# Altium project Bicycle_Project.PrjPcb
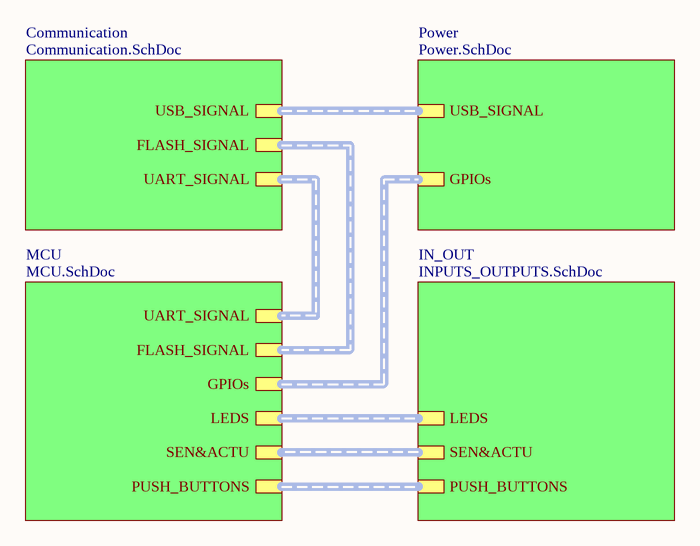
[diagram p0: main.SchDoc]
5 sheets, 108 parts. Net scope: hierarchical (ports join the sheet entries above them; power ports are global).
Board file: Bicycle_Project.PcbDoc
Sheets:
  main.SchDoc
    Communication = Communication.SchDoc
    MCU = MCU.SchDoc
    Power = Power.SchDoc
    IN_OUT = INPUTS_OUTPUTS.SchDoc

## Sheet main.SchDoc: BICYCLE_PROJECT
size A4; SheetNumber: 1; SheetTotal: 5

### Sub-sheets
Communication = Communication.SchDoc: USB_SIGNAL (harness USB_SIGNAL), UART_SIGNAL (harness UART_SIGNAL), FLASH_SIGNAL (harness FLASH_SIGNAL)
IN_OUT = INPUTS_OUTPUTS.SchDoc: LEDS (harness LEDS), PUSH_BUTTONS (harness PUSH_BUTTONS), SEN&ACTU (harness SENSORS&ACTUATORS)
MCU = MCU.SchDoc: UART_SIGNAL (harness UART_SIGNAL), LEDS (harness LEDS), PUSH_BUTTONS (harness PUSH_BUTTONS), FLASH_SIGNAL (harness FLASH_SIGNAL), SEN&ACTU (harness SENSORS&ACTUATORS), GPIOs (harness GPIOs)
Power = Power.SchDoc: USB_SIGNAL (harness USB_SIGNAL), GPIOs (harness GPIOs)

### Buses and harness runs
harness sheet Communication/FLASH_SIGNAL = sheet MCU/FLASH_SIGNAL
harness sheet Communication/UART_SIGNAL = sheet MCU/UART_SIGNAL
harness sheet Communication/USB_SIGNAL = sheet Power/USB_SIGNAL
harness sheet IN_OUT/LEDS = sheet MCU/LEDS
harness sheet IN_OUT/PUSH_BUTTONS = sheet MCU/PUSH_BUTTONS
harness sheet IN_OUT/SEN&ACTU = sheet MCU/SEN&ACTU
harness sheet MCU/GPIOs = sheet Power/GPIOs

## Sheet Communication.SchDoc
size A4; SheetNumber: 4; SheetTotal: 5
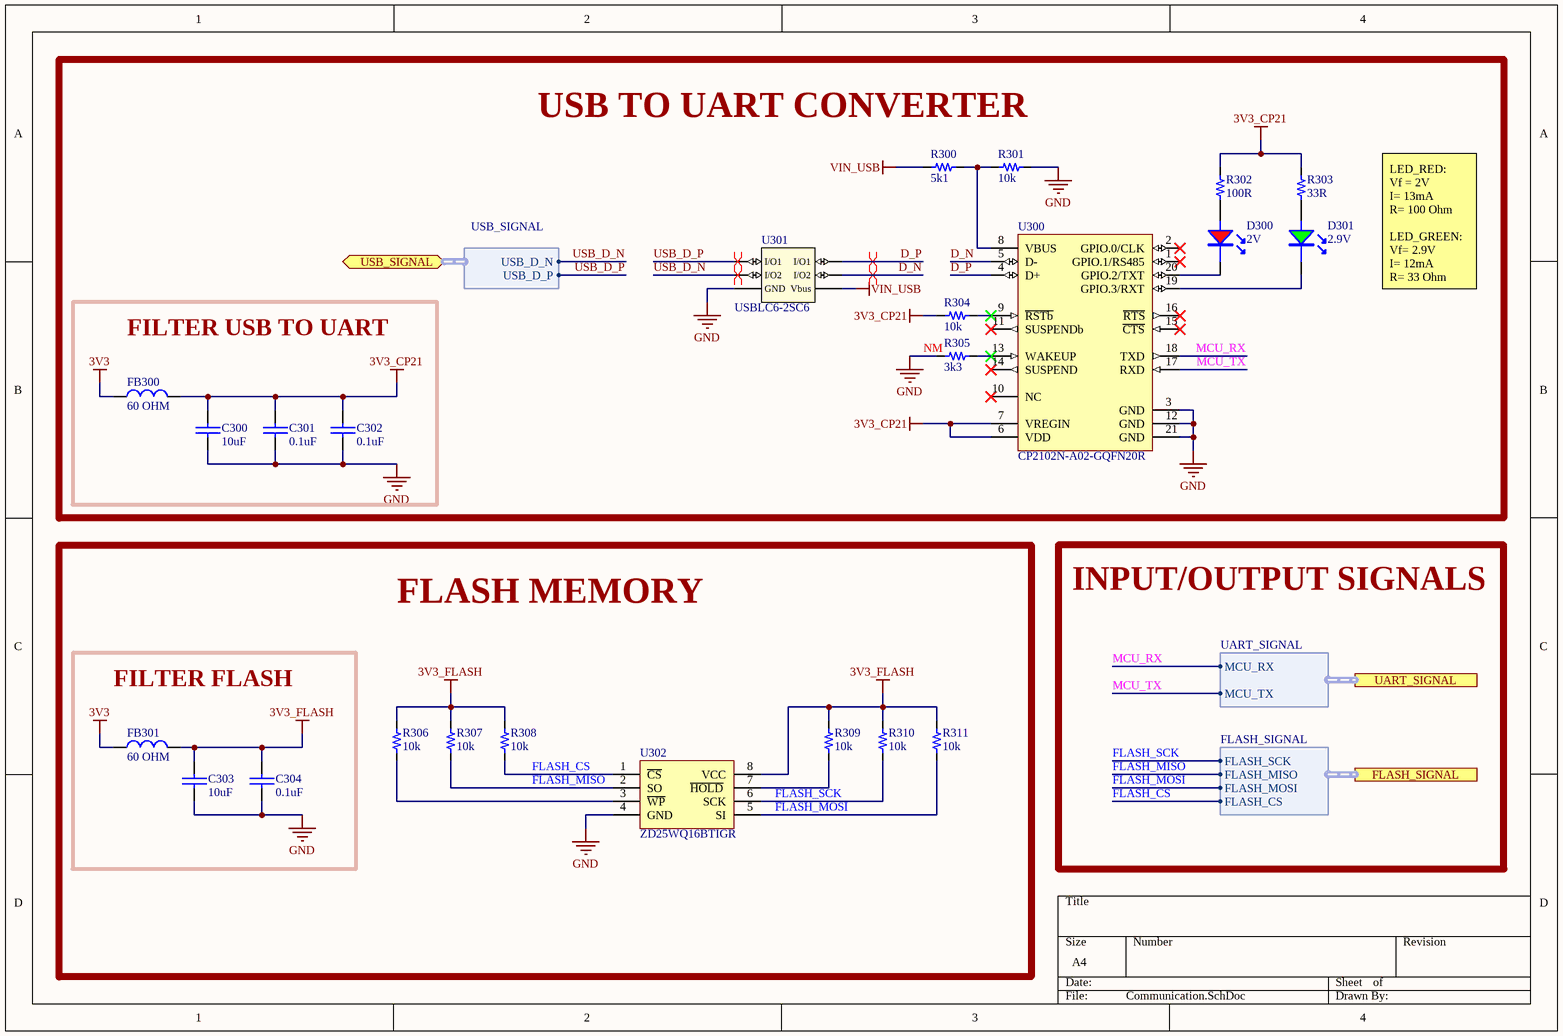
[diagram p1: Communication.SchDoc]

### Parts
C300  value 10uF  [0603_cap]  (hidden comment: 10uF 10V)
C301  value 0.1uF  [0603_cap]  (hidden comment: 0.1uF 50V)
C302  value 0.1uF  [0603_cap]  (hidden comment: 0.1uF 50V)
C303  value 10uF  [0603_cap]  (hidden comment: 10uF 10V)
C304  value 0.1uF  [0603_cap]  (hidden comment: 0.1uF 50V)
D300  2V  [0805_LED]
D301  2.9V  [0805_LED]
FB300  value 60 OHM  [0603_fb]  (hidden comment: 60OHM 2A)
FB301  value 60 OHM  [0603_fb]  (hidden comment: 60OHM 2A)
R300  value 5k1  [0603_res]  (hidden comment: 5k1 1/10W)
R301  value 10k  [0603_res]  (hidden comment: 10k 1/10W)
R302  value 100R  [0603_res]  (hidden comment: 100R 1/10W)
R303  value 33R  [0603_res]  (hidden comment: 33R 1/10W)
R304  value 10k  [0603_res]  (hidden comment: 10k 1/10W)
R305  value 3k3  Usage: NM  [0603_res]  (hidden comment: 3k3 1/10W)
R306  value 10k  [0603_res]  (hidden comment: 10k 1/10W)
R307  value 10k  [0603_res]  (hidden comment: 10k 1/10W)
R308  value 10k  [0603_res]  (hidden comment: 10k 1/10W)
R309  value 10k  [0603_res]  (hidden comment: 10k 1/10W)
R310  value 10k  [0603_res]  (hidden comment: 10k 1/10W)
R311  value 10k  [0603_res]  (hidden comment: 10k 1/10W)
U300  CP2102N-A02-GQFN20R  [WFQFN_20_EP_3X3MM]
U301  USBLC6-2SC6  [SOT_23_6]
U302  ZD25WQ16BTIGR  [SOIC_8_3.9mm]

### Blocks framed on the sheet
USB TO UART CONVERTER: D300 D301 R300-R305 U300 U301
FILTER USB TO UART: C300-C302 FB300
FLASH MEMORY: R306-R311 U302
FILTER FLASH: C303 C304 FB301

### Ports
FLASH_SIGNAL (harness FLASH_SIGNAL, see main[3B], MCU[4B]), UART_SIGNAL (harness UART_SIGNAL, see main[3B], MCU[4D]), USB_SIGNAL (bidir, harness USB_SIGNAL, see main[3B], Power[2A])

### Harnesses
USB_SIGNAL: USB_D_N, USB_D_P
UART_SIGNAL: MCU_TX, MCU_RX
FLASH_SIGNAL: FLASH_SCK, FLASH_MISO, FLASH_MOSI, FLASH_CS

### Nets
3V3: FB300.1 FB301.2
3V3_CP21: C300.1 C301.1 C302.1 FB300.2 R302.2 R303.2 R304.1 U300.6(VDD) U300.7(VREGIN)
3V3_FLASH: C303.1 C304.1 FB301.1 R306.2 R307.2 R308.1 R309.2 R310.2 R311.2 U302.8(VCC)
GND: C300.2 C301.2 C302.2 C303.2 C304.2 R301.2 R305.1 U300.3(GND) U300.12(GND) U300.21(GND) U301.2(GND) U302.4(GND)
VIN_USB: R300.1 U301.5(Vbus)
D_N: U300.5(D-) U301.4(I/O2)
D_P: U300.4(D+) U301.6(I/O1)
FLASH_CS: R308.2 U302.1(~{CS}) ; port FLASH_SIGNAL.FLASH_CS
FLASH_MISO: R307.1 U302.2(SO) ; port FLASH_SIGNAL.FLASH_MISO
FLASH_MOSI: R311.1 U302.5(SI) ; port FLASH_SIGNAL.FLASH_MOSI
FLASH_SCK: R310.1 U302.6(SCK) ; port FLASH_SIGNAL.FLASH_SCK
MCU_RX: U300.18(TXD) ; port UART_SIGNAL.MCU_RX
MCU_TX: U300.17(RXD) ; port UART_SIGNAL.MCU_TX
USB_D_N: U301.3(I/O2) ; port USB_SIGNAL.USB_D_N
USB_D_P: U301.1(I/O1) ; port USB_SIGNAL.USB_D_P
NetD300_1: D300.1(A) R302.1
NetD300_2: D300.2 U300.20(GPIO.2/TXT)
NetD301_1: D301.1(A) R303.1
NetD301_2: D301.2 U300.19(GPIO.3/RXT)
NetR300_2: R300.2 R301.1 U300.8(VBUS)
NetR304_2: R304.2 U300.9(~{RSTb})
NetR305_2: R305.2 U300.13(WAKEUP)
NetR306_1: R306.1 U302.3(~{WP})
NetR309_1: R309.1 U302.7(~{HOLD})

Not connected (* = marked no-connect by the designer): U300 1(GPIO.1/RS485)* 2(GPIO.0/CLK)* 10(NC)* 11(SUSPENDb)* 14(SUSPEND)* 15(~{CTS})* 16(~{RTS})*

### Layout directives
differential pair: D_N, D_P, USB_D_N, USB_D_P

### Notes on the sheet
- LED_RED:
  Vf = 2V
  I= 13mA
  R= 100 Ohm
  LED_GREEN:
  Vf= 2.9V
  I= 12mA
  R= 33 Ohm
- INPUT/OUTPUT SIGNALS

### Library data of the parts
C300 C303 = Cap_10uF_0603_10V: 10V 10uF X5R ±10% 0603 Multilayer Ceramic Capacitors MLCC - SMD/SMT ROHS; Manufacturer: CCTC; Manufacturer Part Number: TCC0603X5R106K100CT; Supplier 1: LCSC; Supplier Part Number 1: C380314; ComponentLink1Description: LCSC; ComponentLink1URL: https://www.lcsc.com/product-detail/Multilayer-Ceramic-Capacitors-MLCC-SMD-SMT_CCTC-TCC0603X5R106K100CT_C380314.html
C301 C302 C304 = Cap_0.1uF_0603_50V: 50V 100nF Y5V -20%~+80% 0603 Multilayer Ceramic Capacitors MLCC - SMD/SMT ROHS; Manufacturer: Walsin Tech Corp; Manufacturer Part Number: 0603F104Z500CT; Supplier 1: LCSC; Supplier Part Number 1: C83060; ComponentLink1Description: LCSC; ComponentLink1URL: https://www.lcsc.com/product-detail/Multilayer-Ceramic-Capacitors-MLCC-SMD-SMT_Walsin-Tech-Corp-0603F104Z500CT_C83060.html
D300 = LED_0805_RED: LED RED CLEAR 0805 SMD; Manufacturer: XINGLIGHT; Manufacturer Part Number: XL-2012SURC; Supplier 1: LCSC; Supplier Part Number 1: C965812; ComponentLink1Description: LCSC; ComponentLink1URL: https://www.lcsc.com/product-detail/Light-Emitting-Diodes-LED_XINGLIGHT-XL-2012SURC_C965812.html
D301 = LED_0805_Green: LED GREEN CLEAR 0805 SMD; Manufacturer: XINGLIGHT; Manufacturer Part Number: XL-2012UGC; Supplier 1: LCSC; Supplier Part Number 1: C965815; ComponentLink1Description: LCSC; ComponentLink1URL: https://www.lcsc.com/product-detail/Light-Emitting-Diodes-LED_XINGLIGHT-XL-2012UGC_C965815.html
FB300 FB301 = FB_60_0603_2A: 2A 1 100mΩ 60Ω@100MHz ±25% 0603 Ferrite Beads ROHS; Manufacturer: TAI-TECH; Manufacturer Part Number: HCB1608KF-600T20; ComponentLink1Description: LCSC; ComponentLink1URL: https://www.lcsc.com/product-detail/Ferrite-Beads_TAI-TECH-HCB1608KF-600T20_C369516.html; Supplier 1: LCSC; Supplier Part Number 1: C369516
R300 = Res_5k1_0603_1/10W: RES SMD 5k1 OHM 5% 1/10W 0603; Manufacturer: FOJAN; Manufacturer Part Number: FRC0603J512 TS; ComponentLink1URL: https://www.lcsc.com/product-detail/Chip-Resistor-Surface-Mount_FOJAN-FRC0603J512-TS_C2907114.html; Supplier 1: LCSC; Supplier Part Number 1: C2907114; ComponentLink1Description: LCSC
R301 R304 R306-R311 = Res_10k_0603_1/10W: RES SMD 10k OHM 5% 1/10W 0603; Manufacturer: FOJAN; Manufacturer Part Number: FRC0603J103TS; ComponentLink1URL: https://www.lcsc.com/product-detail/Chip-Resistor-Surface-Mount_FOJAN-FRC0603J103TS_C2930027.html; Supplier 1: LCSC; Supplier Part Number 1: C2930027; ComponentLink1Description: LCSC
R302 = Res_100R_0603_1/10W: RES SMD 100R OHM 5% 1/10W 0603; Manufacturer: FOJAN; Manufacturer Part Number: FRC0603J101 TS; ComponentLink1URL: https://www.lcsc.com/product-detail/Chip-Resistor-Surface-Mount_FOJAN-FRC0603J101-TS_C2907089.html; Supplier 1: LCSC; Supplier Part Number 1: C2907089; ComponentLink1Description: LCSC
R303 = Res_33R_0603_1/10W: RES SMD 33R OHM 5% 1/10W 0603; Manufacturer: FOJAN; Manufacturer Part Number: FRC0603J330 TS; ComponentLink1URL: https://www.lcsc.com/product-detail/Chip-Resistor-Surface-Mount_FOJAN-FRC0603J330-TS_C2907154.html; Supplier 1: LCSC; Supplier Part Number 1: C2907154; ComponentLink1Description: LCSC
R305 = Res_3k3_0603_1/10W: RES SMD 3k3 OHM 5% 1/10W 0603; Manufacturer: FOJAN; Manufacturer Part Number: FRC0603J332 TS; ComponentLink1URL: https://www.lcsc.com/product-detail/Chip-Resistor-Surface-Mount_FOJAN-FRC0603J332-TS_C2907140.html; Supplier 1: LCSC; Supplier Part Number 1: C2907140; ComponentLink1Description: LCSC
U300 = IC_SGL_USB2UART-BRIDGE_20QFN: IC USB TO UART BRIDGE QFN20; Manufacturer: Silicon Labs; Manufacturer Part Number: CP2102N-A02-GQFN20R; Supplier 1: LCSC; Supplier Part Number 1: C969913; ComponentLink1Description: LCSC; ComponentLink1URL: https://www.lcsc.com/product-detail/USB-ICs_SILICON-LABS-CP2102N-A02-GQFN20R_C969913.html
U301 = TVS_5.25V_2CH_SOT_23_6: TVS DIODE 5.25V 17V SOT23-6; Manufacturer: STMicroelectronics; ComponentLink1Description: LCSC; ComponentLink1URL: https://www.lcsc.com/product-detail/ESD-Protection-Devices_STMicroelectronics-USBLC6-2SC6_C7519.html; Supplier 1: LCSC; Manufacturer Part Number: USBLC6-2SC6; Supplier Part Number 1: C7519
U302 = IC_FLASH_ZD25WQ16BTIGR_8SOP: IC FLASH 16M SPI 85MHZ 8SOP; Manufacturer: Zetta; Manufacturer Part Number: ZD25WQ16BTIGR; Supplier 1: LCSC; Supplier Part Number 1: C2896790; ComponentLink1Description: LCSC; ComponentLink1URL: https://www.lcsc.com/product-detail/NOR-FLASH_Zetta-ZD25WQ16BTIGR_C2896790.html

## Sheet MCU.SchDoc
size A4; SheetNumber: 2; SheetTotal: 5
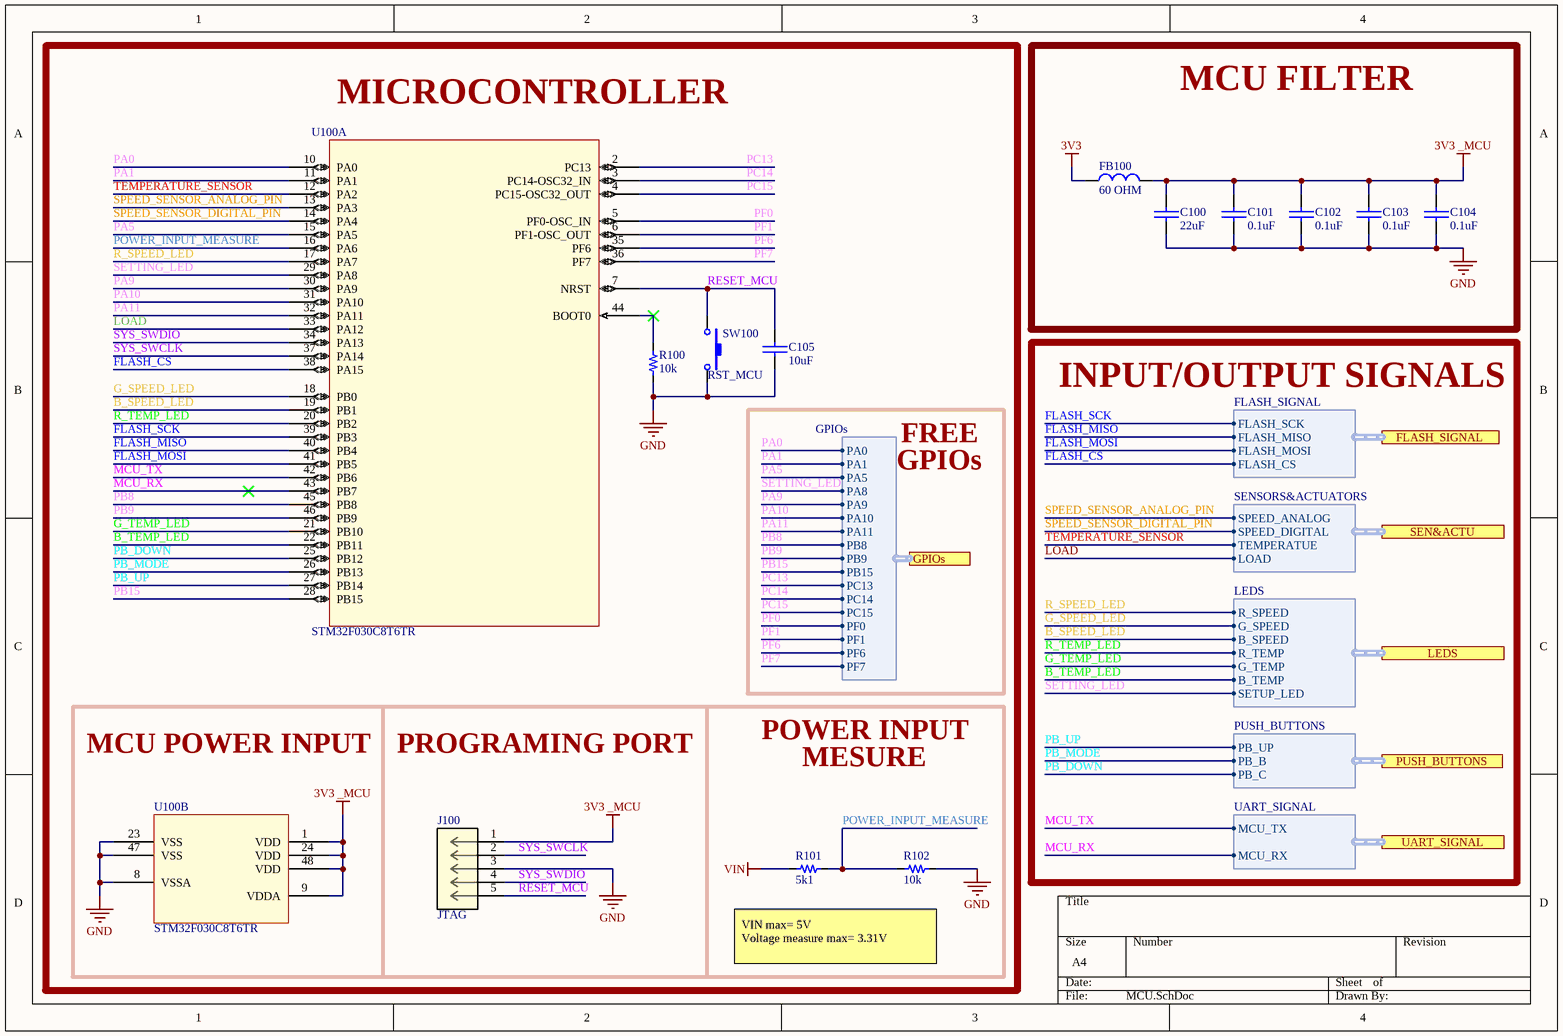
[diagram p2: MCU.SchDoc]

### Parts
C100  value 22uF  [0603_cap]  (hidden comment: 22uF 6V3)
C101  value 0.1uF  [0603_cap]  (hidden comment: 0.1uF 50V)
C102  value 0.1uF  [0603_cap]  (hidden comment: 0.1uF 50V)
C103  value 0.1uF  [0603_cap]  (hidden comment: 0.1uF 50V)
C104  value 0.1uF  [0603_cap]  (hidden comment: 0.1uF 50V)
C105  value 10uF  [0603_cap]  (hidden comment: 10uF 10V)
FB100  value 60 OHM  [0603_fb]  (hidden comment: 60OHM 2A)
J100  JTAG  [CON_5X1_TH_2.54mm]
R100  value 10k  [0603_res]  (hidden comment: 10k 1/10W)
R101  value 5k1  [0603_res]  (hidden comment: 5k1 1/10W)
R102  value 10k  [0603_res]  (hidden comment: 10k 1/10W)
SW100  RST_MCU  [Sw_PUSH_4.5x4.5x5mm]
U100  STM32F030C8T6TR  [LQFP48_7x7mm]  (parts A,B of 2)

### Blocks framed on the sheet
MICROCONTROLLER: C105 J100 R100-R102 SW100 U100
MCU FILTER: C100-C104 FB100

### Ports
FLASH_SIGNAL (harness FLASH_SIGNAL, see main[3C], Communication[4D]), GPIOs (harness GPIOs, see main[3C], Power[3C]), LEDS (harness LEDS, see main[3C], INPUTS_OUTPUTS[4B]), PUSH_BUTTONS (harness PUSH_BUTTONS, see main[3C], INPUTS_OUTPUTS[4B]), SEN&ACTU (harness SENSORS&ACTUATORS, see main[3C], INPUTS_OUTPUTS[4A]), UART_SIGNAL (harness UART_SIGNAL, see main[3B], Communication[4C])

### Harnesses
LEDS: R_SPEED, G_SPEED, B_SPEED, R_TEMP, G_TEMP, B_TEMP, SETUP_LED
SENSORS&ACTUATORS: SPEED_ANALOG, SPEED_DIGITAL, TEMPERATUE, LOAD
PUSH_BUTTONS: PB_UP, PB_B, PB_C
FLASH_SIGNAL: FLASH_SCK, FLASH_MISO, FLASH_MOSI, FLASH_CS
UART_SIGNAL: MCU_TX, MCU_RX
GPIOs: PA0, PA1, PA5, PA8, PA9, PA10, PA11, PB8, PB9, PB15, PC13, PC14, PC15, PF0, PF1, PF6, PF7

### Nets
3V3: FB100.2
3V3 _MCU: C100.1 C101.1 C102.1 C103.1 C104.1 FB100.1 J100.1 U100.1(VDD) U100.9(VDDA) U100.24(VDD) U100.48(VDD)
GND: C100.2 C101.2 C102.2 C103.2 C104.2 C105.2 J100.3 R100.2 R102.1 SW100.2 U100.8(VSSA) U100.23(VSS) U100.47(VSS)
VIN: R101.2
B_SPEED_LED: U100.19(PB1) ; port LEDS.B_SPEED
B_TEMP_LED: U100.22(PB11) ; port LEDS.B_TEMP
FLASH_CS: U100.38(PA15) ; port FLASH_SIGNAL.FLASH_CS
FLASH_MISO: U100.40(PB4) ; port FLASH_SIGNAL.FLASH_MISO
FLASH_MOSI: U100.41(PB5) ; port FLASH_SIGNAL.FLASH_MOSI
FLASH_SCK: U100.39(PB3) ; port FLASH_SIGNAL.FLASH_SCK
G_SPEED_LED: U100.18(PB0) ; port LEDS.G_SPEED
G_TEMP_LED: U100.21(PB10) ; port LEDS.G_TEMP
LOAD: U100.33(PA12) ; port SEN&ACTU.LOAD
MCU_RX: U100.43(PB7) ; port UART_SIGNAL.MCU_RX
MCU_TX: U100.42(PB6) ; port UART_SIGNAL.MCU_TX
PA0: U100.10(PA0) ; port GPIOs.PA0
PA1: U100.11(PA1) ; port GPIOs.PA1
PA5: U100.15(PA5) ; port GPIOs.PA5
PA9: U100.30(PA9) ; port GPIOs.PA9
PA10: U100.31(PA10) ; port GPIOs.PA10
PA11: U100.32(PA11) ; port GPIOs.PA11
PB8: U100.45(PB8) ; port GPIOs.PB8
PB9: U100.46(PB9) ; port GPIOs.PB9
PB15: U100.28(PB15) ; port GPIOs.PB15
PB_DOWN: U100.25(PB12) ; port PUSH_BUTTONS.PB_C
PB_MODE: U100.26(PB13) ; port PUSH_BUTTONS.PB_B
PB_UP: U100.27(PB14) ; port PUSH_BUTTONS.PB_UP
PC13: U100.2(PC13) ; port GPIOs.PC13
PC14: U100.3(PC14-OSC32_IN) ; port GPIOs.PC14
PC15: U100.4(PC15-OSC32_OUT) ; port GPIOs.PC15
PF0: U100.5(PF0-OSC_IN) ; port GPIOs.PF0
PF1: U100.6(PF1-OSC_OUT) ; port GPIOs.PF1
PF6: U100.35(PF6) ; port GPIOs.PF6
PF7: U100.36(PF7) ; port GPIOs.PF7
POWER_INPUT_MEASURE: R101.1 R102.2 U100.16(PA6)
R_SPEED_LED: U100.17(PA7) ; port LEDS.R_SPEED
R_TEMP_LED: U100.20(PB2) ; port LEDS.R_TEMP
RESET_MCU: C105.1 J100.5 SW100.1 U100.7(NRST)
SETTING_LED: U100.29(PA8) ; port LEDS.SETUP_LED, port GPIOs.PA8
SPEED_SENSOR_ANALOG_PIN: U100.13(PA3) ; port SEN&ACTU.SPEED_ANALOG
SPEED_SENSOR_DIGITAL_PIN: U100.14(PA4) ; port SEN&ACTU.SPEED_DIGITAL
SYS_SWCLK: J100.2 U100.37(PA14)
SYS_SWDIO: J100.4 U100.34(PA13)
TEMPERATURE_SENSOR: U100.12(PA2) ; port SEN&ACTU.TEMPERATUE
NetR100_1: R100.1 U100.44(BOOT0)

### Notes on the sheet
- FREE
- INPUT/OUTPUT SIGNALS
- GPIOs
- MCU POWER INPUT
- PROGRAMING PORT
- POWER INPUT
- MESURE
- VIN max= 5V
  Voltage measure max= 3.31V

### Library data of the parts
C100 = Cap_22uF_0805_6V3: 6.3V 22uF X5R ±20% 0805 Multilayer Ceramic Capacitors MLCC - SMD/SMT ROHS; Manufacturer: Samsung Electro-Mechanics; Manufacturer Part Number: CL21A226MQQNNNE; Supplier 1: LCSC; Supplier Part Number 1: C5674; ComponentLink1Description: LCSC; ComponentLink1URL: https://www.lcsc.com/product-detail/Multilayer-Ceramic-Capacitors-MLCC-SMD-SMT_Samsung-Electro-Mechanics-CL21A226MQQNNNE_C5674.html
C101-C104 = Cap_0.1uF_0603_50V: as C301 on sheet Communication; Supplier 1: LCSC; Supplier Part Number 1: C83060; ComponentLink1Description: LCSC; ComponentLink1URL: https://www.lcsc.com/product-detail/Multilayer-Ceramic-Capacitors-MLCC-SMD-SMT_Walsin-Tech-Corp-0603F104Z500CT_C83060.html
C105 = Cap_10uF_0603_10V: as C300 on sheet Communication; Supplier 1: LCSC; Supplier Part Number 1: C380314; ComponentLink1Description: LCSC; ComponentLink1URL: https://www.lcsc.com/product-detail/Multilayer-Ceramic-Capacitors-MLCC-SMD-SMT_CCTC-TCC0603X5R106K100CT_C380314.html
FB100 = FB_60_0603_2A: as FB300 on sheet Communication; ComponentLink1Description: LCSC; ComponentLink1URL: https://www.lcsc.com/product-detail/Ferrite-Beads_TAI-TECH-HCB1608KF-600T20_C369516.html; Supplier 1: LCSC; Supplier Part Number 1: C369516
J100 = Con_5x1_TH_2.54mm: CONN HEADER VERT 5POS 2.54MM; Manufacturer: Samtec Inc.; Manufacturer Part Number: TS-105-T-A; Supplier 1: DigiKey; Supplier Part Number 1: SAM1112-05-ND; ComponentLink1Description: Digi-Key; ComponentLink1URL: https://www.digikey.com/en/products/detail/samtec-inc/TS-105-T-A/1105489?_gl=1*1t1dcus*_up*MQ..&gclid=Cj0KCQjw-_mvBhDwARIsAA-Q0Q5KBzpfdY0H_Ffe6QJIFDLMjPjB3ZOAgeyRFeaxKSID7sFc7WuggU8aAnqfEALw_wcB
R100 R102 = Res_10k_0603_1/10W: as R301 on sheet Communication; ComponentLink1URL: https://www.lcsc.com/product-detail/Chip-Resistor-Surface-Mount_FOJAN-FRC0603J103TS_C2930027.html; Supplier 1: LCSC; Supplier Part Number 1: C2930027; ComponentLink1Description: LCSC
R101 = Res_5k1_0603_1/10W: as R300 on sheet Communication; ComponentLink1URL: https://www.lcsc.com/product-detail/Chip-Resistor-Surface-Mount_FOJAN-FRC0603J512-TS_C2907114.html; Supplier 1: LCSC; Supplier Part Number 1: C2907114; ComponentLink1Description: LCSC
SW100 = Sw_PUSH_4.5x4.5x5.0xmm: SWITCH TACTILE SPST-NO 0.05A 12V; Manufacturer: BZCN; Manufacturer Part Number: TSC015A05026A; Supplier 1: LCSC; Supplier Part Number 1: C2888509; Last modified by: N-A.Potosi; Last modified date: 20190222; ComponentLink1Description: LCSC; ComponentLink1URL: https://www.lcsc.com/product-detail/Tactile-Switches_BZCN-TSC015A05026A_C2888509.html
U100 = IC_STM32F030C8T6TR_LQFP48_7x7MM: IC MCU 32BIT 64KB FLASH 48LQFP; Manufacturer: STMicroelectronics; Manufacturer part number: STM32F030C8T6TR; Supplier 1: LCSC; Supplier Part Number 1: C23922; ComponentLink1Description: LCSC; ComponentLink1URL: https://www.lcsc.com/product-detail/ST-Microelectronics_STMicroelectronics-STM32F030C8T6_C23922.html

## Sheet Power.SchDoc
size A4; SheetNumber: 3; SheetTotal: 5
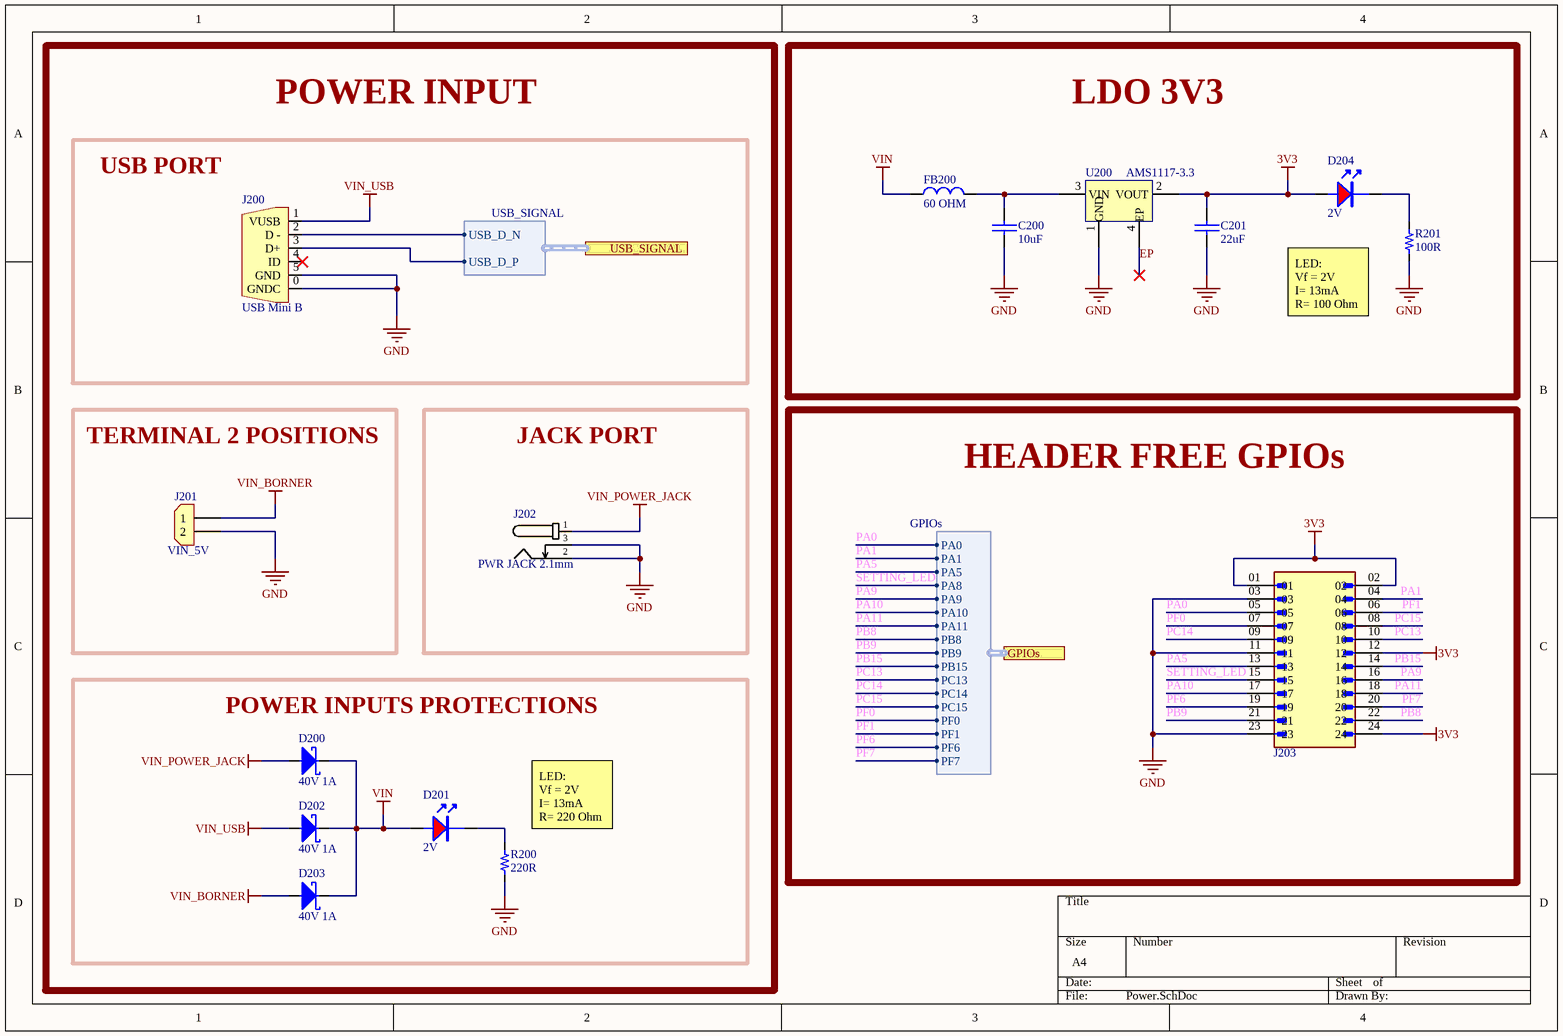
[diagram p3: Power.SchDoc]

### Parts
C200  value 10uF  [0603_cap]  (hidden comment: 10uF 10V)
C201  value 22uF  [0603_cap]  (hidden comment: 22uF 6V3)
D200  40V 1A  [SOD_123]
D201  2V  [0805_LED]
D202  40V 1A  [SOD_123]
D203  40V 1A  [SOD_123]
D204  2V  [0805_LED]
FB200  value 60 OHM  [0603_fb]  (hidden comment: 60OHM 2A)
J200  USB Mini B  [CON_5x1_SMD_miniUSB_B]
J201  VIN_5V  [CON_2x1_TH_5MM]
J202  PWR JACK 2.1mm  [CON_POWER_BARREL_2.1MM_3CONN]
J203  10129381-924001BLF  [CON_2x12_th_2.54MM]  (value not drawn)
R200  value 220R  [0603_res]  (hidden comment: 220R 1/10W)
R201  value 100R  [0603_res]  (hidden comment: 100R 1/10W)
U200  AMS1117-3.3  [SOT_223]

### Blocks framed on the sheet
LDO 3V3: C200 C201 D204 FB200 R201 U200
USB PORT: J200
TERMINAL 2 POSITIONS: J201
JACK PORT: J202
HEADER FREE GPIOs: J203
POWER INPUTS PROTECTIONS: D200-D203 R200

### Ports
GPIOs (harness GPIOs, see main[3B], MCU[3C]), USB_SIGNAL (harness USB_SIGNAL, see main[3B], Communication[1B])

### Harnesses
USB_SIGNAL: USB_D_N, USB_D_P
GPIOs: PA0, PA1, PA5, PA8, PA9, PA10, PA11, PB8, PB9, PB15, PC13, PC14, PC15, PF0, PF1, PF6, PF7

### Nets
3V3: C201.1 D204.1(A) J203.01 J203.02 J203.12 J203.24 U200.2(VOUT)
GND: C200.2 C201.2 J200.0(GNDC) J200.5(GND) J201.2 J202.2 J202.3 J203.03 J203.11 J203.23 R200.1 R201.1 U200.1(GND)
VIN: D200.1 D201.1(A) D202.1 D203.1 FB200.1
VIN_BORNER: D203.2 J201.1
VIN_POWER_JACK: D200.2 J202.1
VIN_USB: D202.2 J200.1(VUSB)
EP: U200.4(EP)
PA0: J203.05 ; port GPIOs.PA0
PA1: J203.04 ; port GPIOs.PA1
PA5: J203.13 ; port GPIOs.PA5
PA9: J203.16 ; port GPIOs.PA9
PA10: J203.17 ; port GPIOs.PA10
PA11: J203.18 ; port GPIOs.PA11
PB8: J203.22 ; port GPIOs.PB8
PB9: J203.21 ; port GPIOs.PB9
PB15: J203.14 ; port GPIOs.PB15
PC13: J203.10 ; port GPIOs.PC13
PC14: J203.09 ; port GPIOs.PC14
PC15: J203.08 ; port GPIOs.PC15
PF0: J203.07 ; port GPIOs.PF0
PF1: J203.06 ; port GPIOs.PF1
PF6: J203.19 ; port GPIOs.PF6
PF7: J203.20 ; port GPIOs.PF7
SETTING_LED: J203.15 ; port GPIOs.PA8
USB_D_N: J200.2(D_-) ; port USB_SIGNAL.USB_D_N
USB_D_P: J200.3(D+) ; port USB_SIGNAL.USB_D_P
NetC200_1: C200.1 FB200.2 U200.3(VIN)
NetD201_2: D201.2 R200.2
NetD204_2: D204.2 R201.2

Not connected (* = marked no-connect by the designer): J200 4(ID)*

### Notes on the sheet
- POWER INPUT
- LED:
  Vf = 2V
  I= 13mA
  R= 100 Ohm
- (near R200) LED:
  Vf = 2V
  I= 13mA
  R= 220 Ohm

### Library data of the parts
C200 = Cap_10uF_0603_10V: as C300 on sheet Communication; Supplier 1: LCSC; Supplier Part Number 1: C380314; ComponentLink1Description: LCSC; ComponentLink1URL: https://www.lcsc.com/product-detail/Multilayer-Ceramic-Capacitors-MLCC-SMD-SMT_CCTC-TCC0603X5R106K100CT_C380314.html
C201 = Cap_22uF_0805_6V3: as C100 on sheet MCU; Supplier 1: LCSC; Supplier Part Number 1: C5674; ComponentLink1Description: LCSC; ComponentLink1URL: https://www.lcsc.com/product-detail/Multilayer-Ceramic-Capacitors-MLCC-SMD-SMT_Samsung-Electro-Mechanics-CL21A226MQQNNNE_C5674.html
D200 D202 D203 = D_Schottky_40V_1A_SOD_123F: DIODE SCHOTTKY 40V 1A SOD123F; Manufacturer: Shanghai Prisemi Elec; Manufacturer Part Number: PSBD1DF40V1H; Supplier 1: LCSC; Supplier Part Number 1: C110730; ComponentLink1Description: LCSC; ComponentLink1URL: https://www.lcsc.com/product-detail/Switching-Diode_Shanghai-Prisemi-Elec-PSBD1DF40V1H_C110730.html
D201 D204 = LED_0805_RED: as D300 on sheet Communication; Supplier 1: LCSC; Supplier Part Number 1: C965812; ComponentLink1Description: LCSC; ComponentLink1URL: https://www.lcsc.com/product-detail/Light-Emitting-Diodes-LED_XINGLIGHT-XL-2012SURC_C965812.html
FB200 = FB_60_0603_2A: as FB300 on sheet Communication; ComponentLink1Description: LCSC; ComponentLink1URL: https://www.lcsc.com/product-detail/Ferrite-Beads_TAI-TECH-HCB1608KF-600T20_C369516.html; Supplier 1: LCSC; Supplier Part Number 1: C369516
J200 = Con_Mini_USB_B: CONN RCPT USB2.0 MINI B SMD R/A; Manufacturer Part Number: KH-MINI-SMT-5P-Cu; Manufacturer: EDAC Inc.; ComponentLink1Description: LCSC; ComponentLink1URL: https://datasheet.lcsc.com/lcsc/2106070035_Shenzhen-Kinghelm-Elec-KH-MINI-SMT-5P-Cu_C2688795.pdf; Supplier 1: LCSC; Supplier Part Number 1: C2688795
J201 = Con_2x1_TH_5mm: 2POS 5MM; Manufacturer: JILN; Manufacturer Part Number: JL126-50002G01; Supplier 1: LCSC; Supplier Part Number 1: C394556; ComponentLink1Description: Digi-Key; ComponentLink1URL: https://www.lcsc.com/product-detail/Screw-terminal_JILN-JL126-50002G01_C394556.html
J202 = Con_Power_Jack_2.1mm_3pins: CONN PWR JACK 2X5.5MM SOLDER; Manufacturer: HCTL; Manufacturer Part Number: HC-DC-005-2.0T; Supplier 1: LCSC; Supplier Part Number 1: C3010533; ComponentLink1Description: LCSC; ComponentLink1URL: https://www.lcsc.com/product-detail/AC-DC-Power-Connectors_HCTL-HC-DC-005-2-0T_C3010533.html
J203 = Con_2x12_TH_2.54mm: CONN HEADER VERT 24POS 2.54MM; Manufacturer: Amphenol ICC (FCI); Manufacturer Part Number: 10129381-924001BLF; Supplier 1: Digi-Key; Supplier Part Number 1: 10129381-924001BLF-ND; Value: *; ComponentLink1Description: Digi-Key; ComponentLink1URL: *
R200 = Res_220R_0603_1/10W: RES SMD 220R OHM 5% 1/10W 0603; Manufacturer: FOJAN; Manufacturer Part Number: FRC0603J221 TS; ComponentLink1URL: https://www.lcsc.com/product-detail/Chip-Resistor-Surface-Mount_FOJAN-FRC0603J221-TS_C2907127.html; Supplier 1: LCSC; Supplier Part Number 1: C2907127; ComponentLink1Description: LCSC
R201 = Res_100R_0603_1/10W: as R302 on sheet Communication; ComponentLink1URL: https://www.lcsc.com/product-detail/Chip-Resistor-Surface-Mount_FOJAN-FRC0603J101-TS_C2907089.html; Supplier 1: LCSC; Supplier Part Number 1: C2907089; ComponentLink1Description: LCSC
U200 = LDO_3V3_1A_FIXED: 1A 60dB@(120Hz) Fixed 3.3V Positive 18V SOT-223 Linear Voltage Regulators (LDO) ROHS; Manufacturer: UMW(Youtai Semiconductor Co., Ltd.); ComponentLink1Description: LCSC; ComponentLink1URL: https://www.lcsc.com/product-detail/_UMW-Youtai-Semiconductor-Co-Ltd-_C347222.html; Supplier 1: LCSC; Manufacturer Part Number: AMS1117-3.3; Supplier Part Number 1: C347222

## Sheet INPUTS_OUTPUTS.SchDoc
size A; SheetNumber: 5; SheetTotal: 5
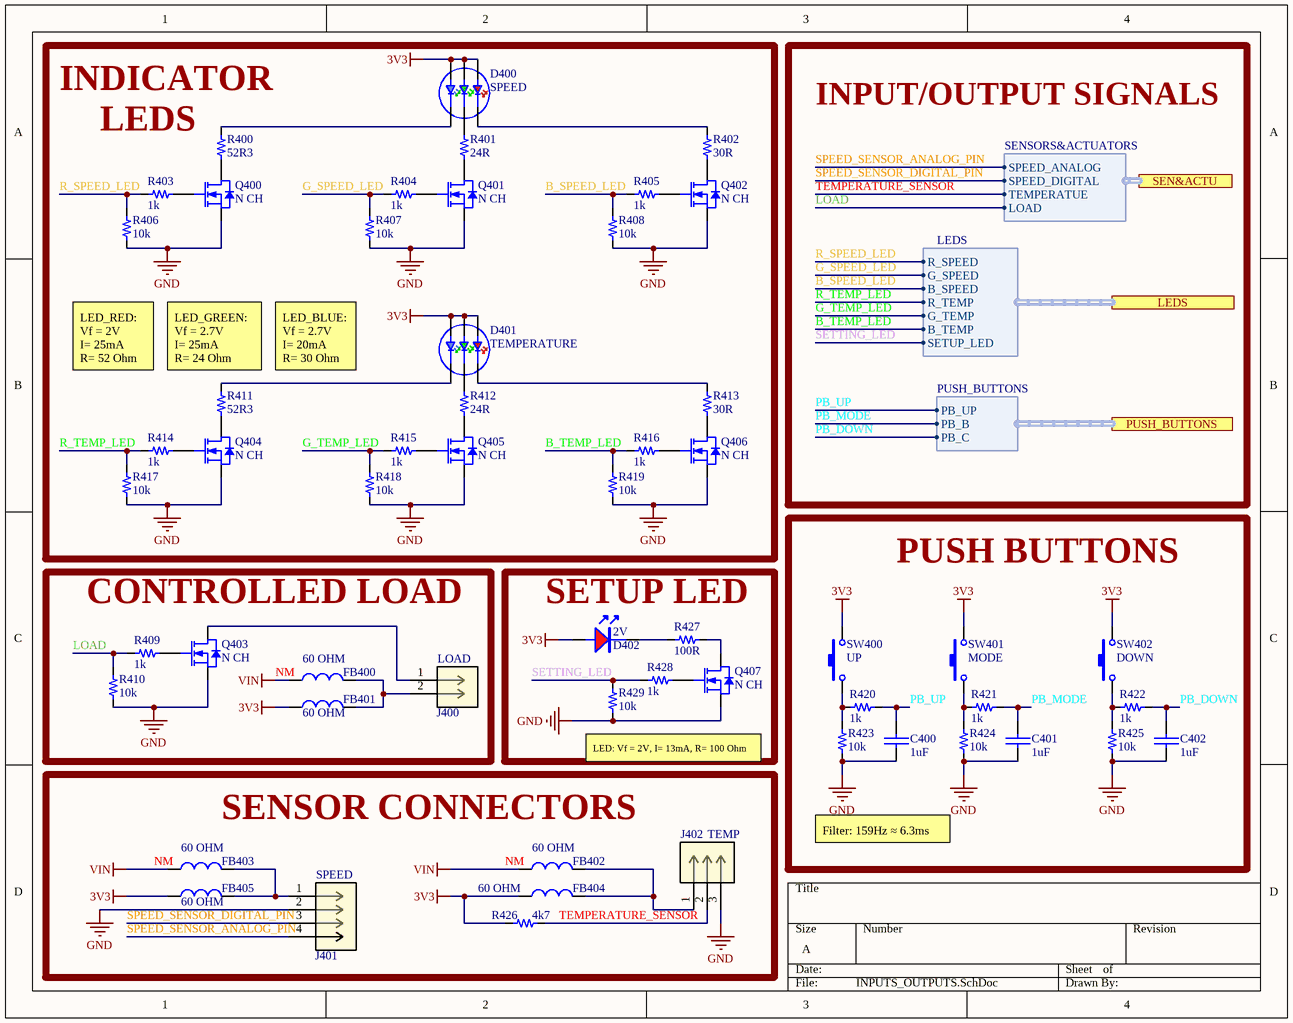
[diagram p4: INPUTS_OUTPUTS.SchDoc]

### Parts
C400  value 1uF  [0603_cap]  (hidden comment: 1uF 50V)
C401  value 1uF  [0603_cap]  (hidden comment: 1uF 50V)
C402  value 1uF  [0603_cap]  (hidden comment: 1uF 50V)
D400  SPEED  [RGB_NS_3.5X3.7]
D401  TEMPERATURE  [RGB_NS_3.5X3.7]
D402  2V  [0805_LED]
FB400  value 60 OHM  Usage: NM  [0603_fb]  (hidden comment: 60OHM 2A)
FB401  value 60 OHM  [0603_fb]  (hidden comment: 60OHM 2A)
FB402  value 60 OHM  Usage: NM  [0603_fb]  (hidden comment: 60OHM 2A)
FB403  value 60 OHM  Usage: NM  [0603_fb]  (hidden comment: 60OHM 2A)
FB404  value 60 OHM  [0603_fb]  (hidden comment: 60OHM 2A)
FB405  value 60 OHM  [0603_fb]  (hidden comment: 60OHM 2A)
J400  LOAD  [CON_2X1_TH_2.54MM]
J401  SPEED  [CON_4X1_TH_2.54MM]
J402  TEMP  [CON_3X1_TH_2.54MM]
Q400  N CH  [SOT_23_3]
Q401  N CH  [SOT_23_3]
Q402  N CH  [SOT_23_3]
Q403  N CH  [SOT_23_3]
Q404  N CH  [SOT_23_3]
Q405  N CH  [SOT_23_3]
Q406  N CH  [SOT_23_3]
Q407  N CH  [SOT_23_3]
R400  value 52R3  [0603_res]  (hidden comment: 52R3 1/10W)
R401  value 24R  [0603_res]  (hidden comment: 24R 1/10W)
R402  value 30R  [0603_res]  (hidden comment: 30 1/10W)
R403  value 1k  [0603_res]  (hidden comment: 1k 1/10W)
R404  value 1k  [0603_res]  (hidden comment: 1k 1/10W)
R405  value 1k  [0603_res]  (hidden comment: 1k 1/10W)
R406  value 10k  [0603_res]  (hidden comment: 10k 1/10W)
R407  value 10k  [0603_res]  (hidden comment: 10k 1/10W)
R408  value 10k  [0603_res]  (hidden comment: 10k 1/10W)
R409  value 1k  [0603_res]  (hidden comment: 1k 1/10W)
R410  value 10k  [0603_res]  (hidden comment: 10k 1/10W)
R411  value 52R3  [0603_res]  (hidden comment: 52R3 1/10W)
R412  value 24R  [0603_res]  (hidden comment: 24R 1/10W)
R413  value 30R  [0603_res]  (hidden comment: 30 1/10W)
R414  value 1k  [0603_res]  (hidden comment: 1k 1/10W)
R415  value 1k  [0603_res]  (hidden comment: 1k 1/10W)
R416  value 1k  [0603_res]  (hidden comment: 1k 1/10W)
R417  value 10k  [0603_res]  (hidden comment: 10k 1/10W)
R418  value 10k  [0603_res]  (hidden comment: 10k 1/10W)
R419  value 10k  [0603_res]  (hidden comment: 10k 1/10W)
R420  value 1k  [0603_res]  (hidden comment: 1k 1/10W)
R421  value 1k  [0603_res]  (hidden comment: 1k 1/10W)
R422  value 1k  [0603_res]  (hidden comment: 1k 1/10W)
R423  value 10k  [0603_res]  (hidden comment: 10k 1/10W)
R424  value 10k  [0603_res]  (hidden comment: 10k 1/10W)
R425  value 10k  [0603_res]  (hidden comment: 10k 1/10W)
R426  value 4k7  [0603_res]  (hidden comment: 4k7 1/10W)
R427  value 100R  [0603_res]  (hidden comment: 100R 1/10W)
R428  value 1k  [0603_res]  (hidden comment: 1k 1/10W)
R429  value 10k  [0603_res]  (hidden comment: 10k 1/10W)
SW400  UP  [Sw_PUSH_4.5x4.5x5mm]
SW401  MODE  [Sw_PUSH_4.5x4.5x5mm]
SW402  DOWN  [Sw_PUSH_4.5x4.5x5mm]

### Blocks framed on the sheet
PUSH BUTTONS: C400-C402 R420-R425 SW400-SW402
CONTROLLED LOAD: FB400 FB401 J400 Q403 R409 R410
SETUP LED: D402 Q407 R427-R429
SENSOR CONNECTORS: FB402-FB405 J401 J402 R426

### Ports
LEDS (harness LEDS, see main[3C], MCU[4C]), PUSH_BUTTONS (harness PUSH_BUTTONS, see main[3C], MCU[4C]), SEN&ACTU (harness SENSORS&ACTUATORS, see main[3C], MCU[4C])

### Harnesses
LEDS: R_SPEED, G_SPEED, B_SPEED, R_TEMP, G_TEMP, B_TEMP, SETUP_LED
SENSORS&ACTUATORS: SPEED_ANALOG, SPEED_DIGITAL, TEMPERATUE, LOAD
PUSH_BUTTONS: PB_UP, PB_B, PB_C

### Nets
3V3: D400.4 D400.5 D400.6 D401.4 D401.5 D401.6 D402.1(A) FB401.1 FB404.1 FB405.1 R426.1 SW400.2 SW401.2 SW402.2
GND: C400.1 C401.1 C402.1 J401.2 J402.3 Q400.2(S) Q401.2(S) Q402.2(S) Q403.2(S) Q404.2(S) Q405.2(S) Q406.2(S) Q407.2(S) R406.1 R407.1 R408.1 R410.1 R417.1 R418.1 R419.1 R423.1 R424.1 R425.1 R429.1
VIN: FB400.1 FB402.1 FB403.1
B_SPEED_LED: R405.1 R408.2 ; port LEDS.B_SPEED
B_TEMP_LED: R416.1 R419.2 ; port LEDS.B_TEMP
G_SPEED_LED: R404.1 R407.2 ; port LEDS.G_SPEED
G_TEMP_LED: R415.1 R418.2 ; port LEDS.G_TEMP
LOAD: R409.1 R410.2 ; port SEN&ACTU.LOAD
PB_DOWN: C402.2 R422.2 ; port PUSH_BUTTONS.PB_C
PB_MODE: C401.2 R421.2 ; port PUSH_BUTTONS.PB_B
PB_UP: C400.2 R420.2 ; port PUSH_BUTTONS.PB_UP
R_SPEED_LED: R403.1 R406.2 ; port LEDS.R_SPEED
R_TEMP_LED: R414.1 R417.2 ; port LEDS.R_TEMP
SETTING_LED: R428.1 R429.2 ; port LEDS.SETUP_LED
SPEED_SENSOR_ANALOG_PIN: J401.4 ; port SEN&ACTU.SPEED_ANALOG
SPEED_SENSOR_DIGITAL_PIN: J401.3 ; port SEN&ACTU.SPEED_DIGITAL
TEMPERATURE_SENSOR: J402.2 R426.2 ; port SEN&ACTU.TEMPERATUE
NetD400_1: D400.1 R400.2
NetD400_2: D400.2 R401.2
NetD400_3: D400.3 R402.2
NetD401_1: D401.1 R411.2
NetD401_2: D401.2 R412.2
NetD401_3: D401.3 R413.2
NetD402_2: D402.2 R427.2
NetFB400_2: FB400.2 FB401.2 J400.2
NetFB402_2: FB402.2 FB404.2 J402.1
NetFB403_2: FB403.2 FB405.2 J401.1
NetJ400_1: J400.1 Q403.3(D)
NetQ400_1: Q400.1(G) R403.2
NetQ400_3: Q400.3(D) R400.1
NetQ401_1: Q401.1(G) R404.2
NetQ401_3: Q401.3(D) R401.1
NetQ402_1: Q402.1(G) R405.2
NetQ402_3: Q402.3(D) R402.1
NetQ403_1: Q403.1(G) R409.2
NetQ404_1: Q404.1(G) R414.2
NetQ404_3: Q404.3(D) R411.1
NetQ405_1: Q405.1(G) R415.2
NetQ405_3: Q405.3(D) R412.1
NetQ406_1: Q406.1(G) R416.2
NetQ406_3: Q406.3(D) R413.1
NetQ407_1: Q407.1(G) R428.2
NetQ407_3: Q407.3(D) R427.1
NetR420_1: R420.1 R423.2 SW400.1
NetR421_1: R421.1 R424.2 SW401.1
NetR422_1: R422.1 R425.2 SW402.1

### Notes on the sheet
- (near R400) INDICATOR
- LEDS
- INPUT/OUTPUT SIGNALS
- LED_RED:
  Vf = 2V
  I= 25mA
  R= 52 Ohm
- (near R411) LED_GREEN:
  Vf = 2.7V
  I= 25mA
  R= 24 Ohm
- LED_BLUE:
  Vf = 2.7V
  I= 20mA
  R= 30 Ohm
- LED: Vf = 2V, I= 13mA, R= 100 Ohm
- Filter: 159Hz ≈ 6.3ms

### Library data of the parts
C400-C402 = Cap_1uF_0603_50V: 50V 1uF X5R ±10% 0603 Multilayer Ceramic Capacitors MLCC - SMD/SMT ROHS; Manufacturer: Samsung Electro-Mechanics; Manufacturer Part Number: CL10A105KB8NNNC; Supplier 1: LCSC; Supplier Part Number 1: C15849; ComponentLink1Description: LCSC; ComponentLink1URL: https://www.lcsc.com/product-detail/Multilayer-Ceramic-Capacitors-MLCC-SMD-SMT_Samsung-Electro-Mechanics-CL10A105KB8NNNC_C15849.html
D400 D401 = LED_RGB_3535_SMD: -30℃~+85℃ RGB 110° 3535(mm) Light Emitting Diodes (LED) ROHS; Manufacturer: Foshan NationStar Optoelectronics; Manufacturer Part Number: RS-3535MWAM; Supplier 1: LCSC; Supplier Part Number 1: C842778; ComponentLink1Description: LCSC; ComponentLink1URL: https://www.lcsc.com/product-detail/Light-Emitting-Diodes-LED_Foshan-NationStar-Optoelectronics-RS-3535MWAM_C842778.html
D402 = LED_0805_RED: as D300 on sheet Communication; Supplier 1: LCSC; Supplier Part Number 1: C965812; ComponentLink1Description: LCSC; ComponentLink1URL: https://www.lcsc.com/product-detail/Light-Emitting-Diodes-LED_XINGLIGHT-XL-2012SURC_C965812.html
FB400-FB405 = FB_60_0603_2A: as FB300 on sheet Communication; ComponentLink1Description: LCSC; ComponentLink1URL: https://www.lcsc.com/product-detail/Ferrite-Beads_TAI-TECH-HCB1608KF-600T20_C369516.html; Supplier 1: LCSC; Supplier Part Number 1: C369516
J400 = Con_2x1_TH_2.54mm: CONN HEADER VERT 2POS 2.54MM; Manufacturer: Amphenol ICC (FCI); Manufacturer Part Number: 10129378-902001BLF; Supplier 1: Digi-Key; Supplier Part Number 1: 10129378-902001BLF-ND; Value: *; ComponentLink1Description: Digi-Key; ComponentLink1URL: https://www.digikey.com/en/products/detail/amphenol-cs-fci/10129378-902001BLF/7915924?s=N4IgTCBcDaIIwAY5gJwGYDsAOAtChYCSAQgDIBiIAugL5A
J401 = Con_4X1_TH_2.54mm: CONN HEADER VERT 4POS 2.54MM; Manufacturer: Amphenol ICC (FCI); Manufacturer Part Number: 10129378-904001BLF; Supplier 1: Digi-Key; Supplier Part Number 1: 10129378-904001BLF-ND; Value: *; ComponentLink1Description: Digi-Key; ComponentLink1URL: https://www.digikey.com/en/products/detail/amphenol-cs-fci/10129378-904001BLF/7915932?s=N4IgTCBcDaIIwAY5gJwGYDsAOAtChALAkgEIAyAYiALoC%2BQA
J402 = Con_3X1_TH_2.54mm: CONN HEADER VERT 3POS 2.54MM; Manufacturer: Amphenol ICC (FCI); Manufacturer Part Number: 10129378-903001BLF; Supplier 1: Digi-Key; Supplier Part Number 1: 10129378-903001BLF-ND; Value: *; ComponentLink1Description: Digi-Key; ComponentLink1URL: https://www.digikey.com/en/products/detail/amphenol-cs-fci/10129378-903001BLF/7915928
Q400-Q407 = Q_NFET_20V_3.2A_SOT23: MOSFET N-CH 20V SOT23; Manufacturer: Doeshare; Manufacturer Part Number: DN2302S; Supplier 1: LCSC; Supplier Part Number 1: C2931750; ComponentLink1Description: LCSC; ComponentLink1URL: https://www.lcsc.com/product-detail/MOSFETs_Doeshare-DN2302S_C2931750.html
R400 R411 = Res_52R3_0603_1/10W_1: RES SMD 52R3 OHM 1% 1/10W 0603; Manufacturer: FOJAN; Manufacturer Part Number: FRC0603F52R3TS; ComponentLink1URL: https://www.lcsc.com/product-detail/Chip-Resistor-Surface-Mount_FOJAN-FRC0603F52R3TS_C2998074.html; Supplier 1: LCSC; Supplier Part Number 1: C2998074; ComponentLink1Description: LCSC
R401 R412 = Res_24R_0603_1/10W: RES SMD 24R OHM 5% 1/10W 0603; Manufacturer: FOJAN; Manufacturer Part Number: FRC0603J240 TS; ComponentLink1URL: https://www.lcsc.com/product-detail/Chip-Resistor-Surface-Mount_FOJAN-FRC0603J240-TS_C2907132.html; Supplier 1: LCSC; Supplier Part Number 1: C2907132; ComponentLink1Description: LCSC
R402 R413 = Res_30R_0603_1/10W: RES SMD 30R OHM 1% 1/10W 0603; Manufacturer: FOJAN; Manufacturer Part Number: FRC0603F30R0TS; ComponentLink1URL: https://www.lcsc.com/product-detail/Chip-Resistor-Surface-Mount_FOJAN-FRC0603F30R0TS_C2907026.html; Supplier 1: LCSC; Supplier Part Number 1: C2907026; ComponentLink1Description: LCSC
R403-R405 R409 R414-R416 R420-R422 R428 = Res_1k_0603_1/10W: RES SMD 1k OHM 5% 1/10W 0603; Manufacturer: FOJAN; Manufacturer Part Number: FRC0603J102 TS; ComponentLink1URL: https://www.lcsc.com/product-detail/Chip-Resistor-Surface-Mount_FOJAN-FRC0603J102-TS_C2907113.html; Supplier 1: LCSC; Supplier Part Number 1: C2907113; ComponentLink1Description: LCSC
R406-R408 R410 R417-R419 R423-R425 R429 = Res_10k_0603_1/10W: as R301 on sheet Communication; ComponentLink1URL: https://www.lcsc.com/product-detail/Chip-Resistor-Surface-Mount_FOJAN-FRC0603J103TS_C2930027.html; Supplier 1: LCSC; Supplier Part Number 1: C2930027; ComponentLink1Description: LCSC
R426 = Res_4k7_0603_1/10W: RES SMD 4k7 OHM 5% 1/10W 0603; Manufacturer: FOJAN; Manufacturer Part Number: FRC0603J472 TS; ComponentLink1URL: https://www.lcsc.com/product-detail/Chip-Resistor-Surface-Mount_FOJAN-FRC0603J472-TS_C2907166.html; Supplier 1: LCSC; Supplier Part Number 1: C2907166; ComponentLink1Description: LCSC
R427 = Res_100R_0603_1/10W: as R302 on sheet Communication; ComponentLink1URL: https://www.lcsc.com/product-detail/Chip-Resistor-Surface-Mount_FOJAN-FRC0603J101-TS_C2907089.html; Supplier 1: LCSC; Supplier Part Number 1: C2907089; ComponentLink1Description: LCSC
SW400-SW402 = Sw_PUSH_4.5x4.5x5.0xmm: as SW100 on sheet MCU; Supplier 1: LCSC; Supplier Part Number 1: C2888509; Last modified by: N-A.Potosi; Last modified date: 20190222; ComponentLink1Description: LCSC; ComponentLink1URL: https://www.lcsc.com/product-detail/Tactile-Switches_BZCN-TSC015A05026A_C2888509.html

## Nets that join several sheets
3V3: Communication (FB300.1 FB301.2), MCU (FB100.2), Power (7 pins), INPUTS_OUTPUTS (14 pins)
GND: Communication (12 pins), MCU (13 pins), Power (13 pins), INPUTS_OUTPUTS (24 pins)
VIN: MCU (R101.2), Power (5 pins), INPUTS_OUTPUTS (FB400.1 FB402.1 FB403.1)
VIN_USB: Communication (R300.1 U301.5), Power (D202.2 J200.1)
B_SPEED_LED: MCU (U100.19), INPUTS_OUTPUTS (R405.1 R408.2)
B_TEMP_LED: MCU (U100.22), INPUTS_OUTPUTS (R416.1 R419.2)
FLASH_CS: Communication (R308.2 U302.1), MCU (U100.38)
FLASH_MISO: Communication (R307.1 U302.2), MCU (U100.40)
FLASH_MOSI: Communication (R311.1 U302.5), MCU (U100.41)
FLASH_SCK: Communication (R310.1 U302.6), MCU (U100.39)
G_SPEED_LED: MCU (U100.18), INPUTS_OUTPUTS (R404.1 R407.2)
G_TEMP_LED: MCU (U100.21), INPUTS_OUTPUTS (R415.1 R418.2)
LOAD: MCU (U100.33), INPUTS_OUTPUTS (R409.1 R410.2)
MCU_RX: Communication (U300.18), MCU (U100.43)
MCU_TX: Communication (U300.17), MCU (U100.42)
PA0: MCU (U100.10), Power (J203.05)
PA1: MCU (U100.11), Power (J203.04)
PA5: MCU (U100.15), Power (J203.13)
PA9: MCU (U100.30), Power (J203.16)
PA10: MCU (U100.31), Power (J203.17)
PA11: MCU (U100.32), Power (J203.18)
PB8: MCU (U100.45), Power (J203.22)
PB9: MCU (U100.46), Power (J203.21)
PB15: MCU (U100.28), Power (J203.14)
PB_DOWN: MCU (U100.25), INPUTS_OUTPUTS (C402.2 R422.2)
PB_MODE: MCU (U100.26), INPUTS_OUTPUTS (C401.2 R421.2)
PB_UP: MCU (U100.27), INPUTS_OUTPUTS (C400.2 R420.2)
PC13: MCU (U100.2), Power (J203.10)
PC14: MCU (U100.3), Power (J203.09)
PC15: MCU (U100.4), Power (J203.08)
PF0: MCU (U100.5), Power (J203.07)
PF1: MCU (U100.6), Power (J203.06)
PF6: MCU (U100.35), Power (J203.19)
PF7: MCU (U100.36), Power (J203.20)
R_SPEED_LED: MCU (U100.17), INPUTS_OUTPUTS (R403.1 R406.2)
R_TEMP_LED: MCU (U100.20), INPUTS_OUTPUTS (R414.1 R417.2)
SETTING_LED: MCU (U100.29), Power (J203.15), INPUTS_OUTPUTS (R428.1 R429.2)
SPEED_SENSOR_ANALOG_PIN: MCU (U100.13), INPUTS_OUTPUTS (J401.4)
SPEED_SENSOR_DIGITAL_PIN: MCU (U100.14), INPUTS_OUTPUTS (J401.3)
TEMPERATURE_SENSOR: MCU (U100.12), INPUTS_OUTPUTS (J402.2 R426.2)
USB_D_N: Communication (U301.3), Power (J200.2)
USB_D_P: Communication (U301.1), Power (J200.3)